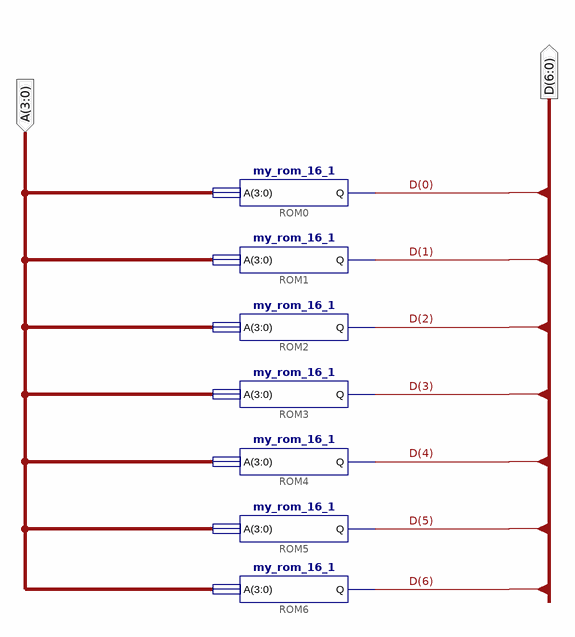
[diagram p0: schematic sheet 1]
// Xilinx ISE schematic my_rom_16_7.sch (virtex6) as structural Verilog: 7 symbols, 2 ports
module my_rom_16_7 (
  input  [3:0] A,
  output [6:0] D
);

  my_rom_16_1 #(.INIT("1111")) ROM0 (.A(A), .Q(D[0]));
  my_rom_16_1 ROM1 (.A(A), .Q(D[1]));
  my_rom_16_1 ROM2 (.A(A), .Q(D[2]));
  my_rom_16_1 ROM3 (.A(A), .Q(D[3]));
  my_rom_16_1 ROM4 (.A(A), .Q(D[4]));
  my_rom_16_1 ROM5 (.A(A), .Q(D[5]));
  my_rom_16_1 ROM6 (.A(A), .Q(D[6]));
endmodule
